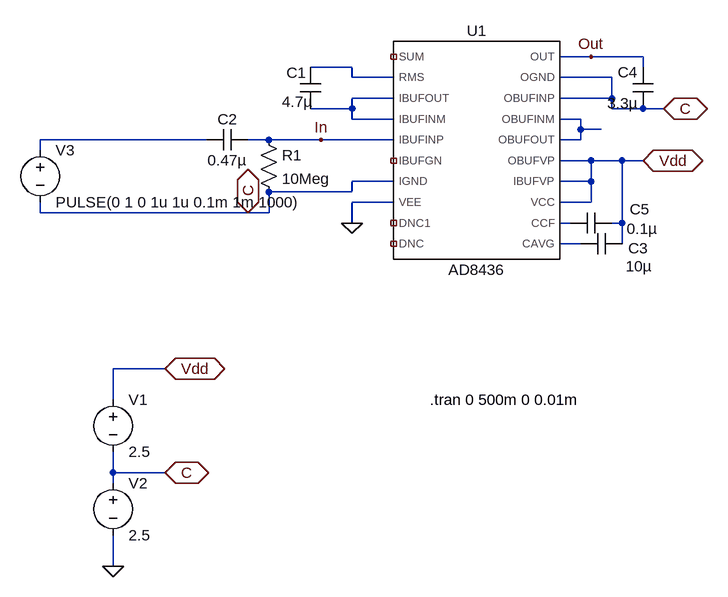
[diagram p0: schematic Citcuit.asc]
Citcuit.asc, the LTspice schematic file:
Version 4
SHEET 1 880 824
WIRE 384 0 336 0
WIRE 464 0 384 0
WIRE 16 16 -48 16
WIRE 464 16 464 0
WIRE 16 32 16 16
WIRE 80 32 16 32
WIRE 416 32 336 32
WIRE 80 64 16 64
WIRE 416 64 416 32
WIRE 416 64 336 64
WIRE 16 80 16 64
WIRE 16 80 -48 80
WIRE 416 80 416 64
WIRE 464 80 416 80
WIRE 496 80 464 80
WIRE 16 96 16 80
WIRE 80 96 16 96
WIRE 368 96 336 96
WIRE 368 112 368 96
WIRE 400 112 368 112
WIRE -208 128 -464 128
WIRE -112 128 -144 128
WIRE -32 128 -112 128
WIRE 80 128 -32 128
WIRE 368 128 368 112
WIRE 368 128 336 128
WIRE -464 144 -464 128
WIRE 384 160 336 160
WIRE 432 160 384 160
WIRE 464 160 432 160
WIRE 80 192 16 192
WIRE 384 192 384 160
WIRE 384 192 336 192
WIRE 16 208 16 192
WIRE 16 208 -112 208
WIRE 80 224 16 224
WIRE 384 224 384 192
WIRE 384 224 336 224
WIRE -464 240 -464 224
WIRE -144 240 -464 240
WIRE -112 240 -112 208
WIRE -112 240 -144 240
WIRE 16 256 16 224
WIRE 352 256 336 256
WIRE 432 256 432 160
WIRE 432 256 416 256
WIRE 368 288 336 288
WIRE 432 288 432 256
WIRE -272 480 -352 480
WIRE -352 528 -352 480
WIRE -352 640 -352 608
WIRE -272 640 -352 640
WIRE -352 656 -352 640
WIRE -352 784 -352 736
FLAG -352 784 0
FLAG -272 480 Vdd
IOPIN -272 480 BiDir
FLAG -272 640 C
IOPIN -272 640 BiDir
FLAG -144 240 C
IOPIN -144 240 BiDir
FLAG 16 256 0
FLAG 384 0 Out
FLAG -32 128 In
FLAG 464 160 Vdd
IOPIN 464 160 BiDir
FLAG 496 80 C
IOPIN 496 80 BiDir
SYMBOL cap -64 16 R0
WINDOW 0 -21 9 Left 2
WINDOW 3 -28 53 Left 2
SYMATTR InstName C1
SYMATTR Value 4.7µ
SYMBOL voltage -352 512 R0
SYMATTR InstName V1
SYMATTR Value 2.5
SYMBOL voltage -352 640 R0
SYMATTR InstName V2
SYMATTR Value 2.5
SYMBOL cap -144 112 R90
WINDOW 0 0 32 VBottom 2
WINDOW 3 32 32 VTop 2
SYMATTR InstName C2
SYMATTR Value 0.47µ
SYMBOL res -128 112 R0
SYMATTR InstName R1
SYMATTR Value 10Meg
SYMBOL voltage -464 128 R0
WINDOW 123 0 0 Left 2
WINDOW 39 0 0 Left 2
SYMATTR InstName V3
SYMATTR Value PULSE(0 1 0 1u 1u 0.1m 1m 1000)
SYMBOL AD8436 208 144 R0
SYMATTR InstName U1
SYMBOL cap 432 272 R90
WINDOW 0 38 -25 VBottom 2
WINDOW 3 35 -26 VTop 2
SYMATTR InstName C3
SYMATTR Value 10µ
SYMBOL cap 416 240 R90
WINDOW 0 10 -43 VBottom 2
WINDOW 3 9 -47 VTop 2
SYMATTR InstName C5
SYMATTR Value 0.1µ
SYMBOL cap 480 80 R180
WINDOW 0 24 56 Left 2
WINDOW 3 24 8 Left 2
SYMATTR InstName C4
SYMATTR Value 3.3µ
TEXT 136 528 Left 2 !.tran 0 500m 0 0.01m

The netlist it stands for:
* Citcuit.asc
C1 N001 N002 4.7µ
V1 Vdd C 2.5
V2 C 0 2.5
C2 In N004 0.47µ
R1 In C 10Meg
V3 N004 C PULSE(0 1 0 1u 1u 0.1m 1m 1000)
XU1 NC_01 N001 N002 N002 In NC_02 NC_03 C Out 0 C C N003 N003 Vdd Vdd Vdd N005 N006 NC_04 AD8436  ; pins DNC1 RMS IBUFOUT IBUFINM IBUFINP IBUFGN DNC OGND OUT VEE IGND OBUFINP OBUFINM OBUFOUT OBUFVP IBUFVP VCC CCF CAVG SUM
C3 Vdd N006 10µ
C5 Vdd N005 0.1µ
C4 C Out 3.3µ
.tran 0 500m 0 0.01m
.lib C:\Users\Semenov_DM\Desktop\Amplitude detection\Library\ad8436.cir
.backanno
.end